# Altium schematic sheet Sheet2.SchDoc
size A4
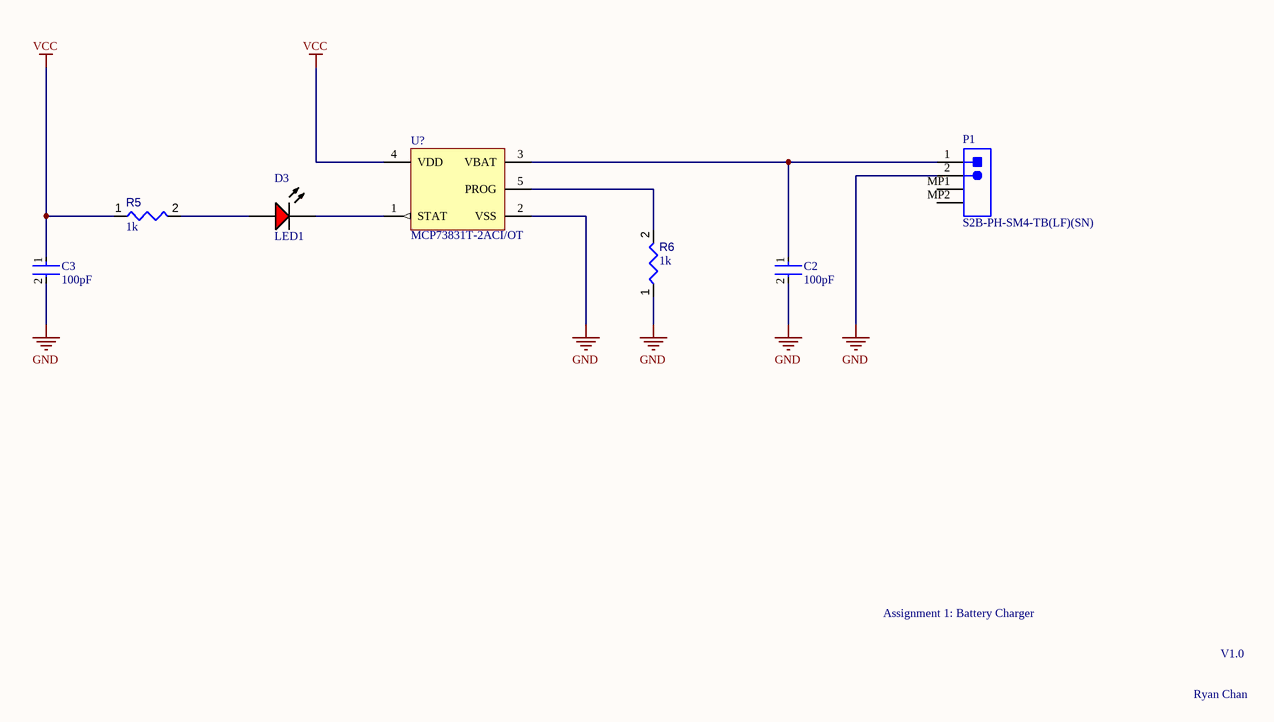
[diagram p0: Sheet2.SchDoc]

## Parts
C2  100pF  [FP-C0402-BB-MFG]
C3  100pF  [FP-C0402-BB-MFG]
D3  LED1  [VISH-TLMX1100_V]
P1  S2B-PH-SM4-TB(LF)(SN)  [JST- S2B-PH-SM4-TB(LF)(SN)-2_V]
R5  value 1k  [RESC0805(2012)_L]  (hidden comment: Resistor 1K +/-5% 0805 125 mW)
R6  value 1k  [RESC0805(2012)_L]  (hidden comment: Resistor 1K +/-5% 0805 125 mW)
U?  MCP73831T-2ACI/OT  [SOT-23-OT5_M]

## Nets
GND: C2.2 C3.2 P1.2 R6.1 U?.2(VSS)
VCC: C3.1 R5.1 U?.4(VDD)
NetC2_1: C2.1 P1.1 U?.3(VBAT)
NetD3_1: D3.1(A) R5.2
NetD3_2: D3.2(K) U?.1(STAT)
NetR6_2: R6.2 U?.5(PROG)

Not connected (* = marked no-connect by the designer): P1 MP1 MP2

## Notes on the sheet
- Assignment 1: Battery Charger
- V1.0
- Ryan Chan

## Library data of the parts
C2 C3 = CMP-03020-016542-1: CAP CER 100PF 50V 10% NP0 0402; Manufacturer Part Number: C0402C101K5GACTU; Manufacturer: Kemet; Tolerance: 0.1; Temperature Coefficient: 15%; Description: C0402 100 pF C0G 10.00% 50 V; Temperature Characteristic: C0G; Material: Ceramic; Automotive: No; Temperature Range High: +125°C; Device Class L3: Ceramic Capacitors; ComponentLink2Description: Datasheet; Temperature Range Low: -55°C; Height: 0.55mm; Package: C0402-BB; Capacitance: 100 pF; Digikey Description: CAP CER 100PF 50V 10% NP0 0402; RoHS: TRUE; Mouser Description: KEMET - C0402C101K5GACTU - CAP, C0G / NP0, 100PF, 50V, 0402; ComponentLink2URL: https://content.kemet.com/datasheets/KEM_C1002_X7R_SMD.pdf; Value: 100 pF; Category: Cap; Device Class L1: Passive Components; Octopart: https://octopart.com/c0402c101k5gactu-kemet-9144183; Device Class L2: Capacitors; Ipc Land Pattern Name: CAPC10050X50; Temperature: -55°C to +125°C; Voltage Rating: 50 V; Lead Free: Yes
D3 = CMP-007-00030-1: Red Led, 20mA, 2.1 V, -40 to 100 degC, 2-Pin SMD (0603), RoHS, Tape and Reel; Manufacturer: Vishay Semiconductor; Forward Voltage: 2.1V; Lens Style: Clear; Luminous Intensity: 63mcd; Power: 90mW; Viewing Angle: 160degrees; Datasheet Version: Rev. 2.7, 03/2016; Package Reference: TLMX1100; Packaging: TapeandReel; Mounting Technology: SM; Illumination Colour: Red; Min Operating Temperature: -40°C; Case/Package: 0603; RoHS Compliant: True; Pins: 2; Max Operating Temperature: 100°C; Datasheet URL: http://www.vishay.com/docs/83173/tlmb1100.pdf; Package Description: 2-Pin Surface Mount Device, Body 1.6 x 0.8 mm; Manufacturer URL: http://www.vishay.com/; Nominal Vf: 2.1V; Colour: Red; Package Quantity: 3000; Forward Current: 20mA
P1 = CMP-002-00031-1: Male Header, Pitch 2 mm, 1 x 2 Position, Height 5.5 mm, -25 to 85 degC, RoHS, Tape and Reel; Manufacturer: JST; Datasheet URL: http://www.jst-mfg.com/product/pdf/eng/ePH.pdf; Connector Type: Header; Manufacturer URL: http://www.jst.com/home2.html; Package Description: Male Header, Pitch 2 mm, 1 x 2 Position, Height 5.5 mm; Max Operating Temperature: 85°C; Gender: Male; Mounting Technology: SM; Package Reference: S2B-PH-SM4-TB(LF)(SN)-2; RoHS Compliant: Unknown; Case/Package: S2B-PH-SM4-TB(LF)(SN)-2; Min Operating Temperature: -25°C; Datasheet Version: Dec-12
R5 R6 = CMP-009-00118-2: Chip Resistor, 1 kOhms, +/-5%, 125 mW, -55 to 155 degC, 0805; Power: 125mW; Tolerance: 5%; Max Operating Temperature: 155°C; Min Operating Temperature: -55°C; Pins: 2; Case/Package: 0805
U? = CMP-0133-00143-1: Miniature Single-Cell, Fully Integrated Li-Ion, Li-Polymer Charge Management Controller, 4.2V, 5-Pin SOT-23, Industrial Temperature, Tape and Reel; PackageReference: SOT-23-OT5; PackageDescription: 5-Lead Plastic Small Outline Transistor (OT) [SOT-23]; PackageVersion: revBB, Aug-2009; DatasheetVersion: revE, Sep-2008; Code_IPC: SOT23-5